# EAGLE schematic switch_driver (EAGLE 7.3.0)
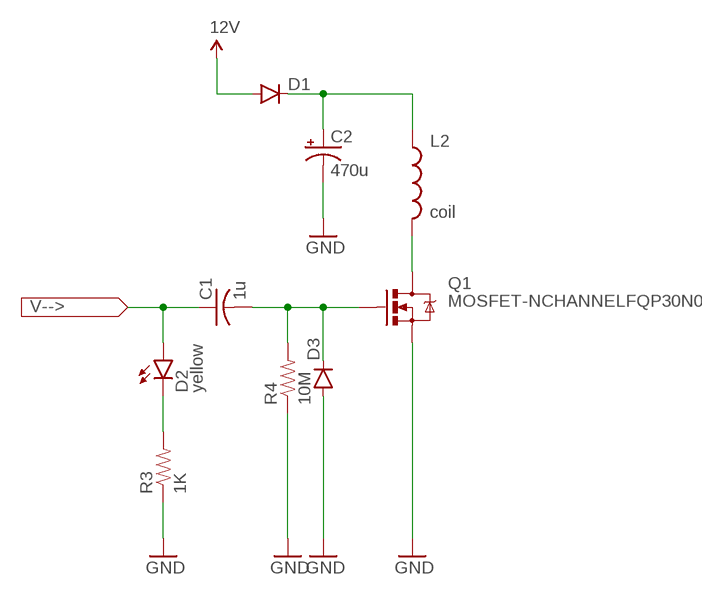
[diagram p0: schematic, sheet 1]

## Parts
C1  1u  C-US025-024X044  [C025-024X044]
C2  470u  CAP_POLPTH1  [CPOL-RADIAL-100UF-25V]
D1  DIODE1N4148  [DIODE-1N4148]
D2  yellow  LED5MM  [LED5MM]
D3  DIODE1N4148  [DIODE-1N4148]
L2  coil  INDUCTOR  [INDUCTOR-SRP4020]
Q1  MOSFET-NCHANNELFQP30N06L  [TO220V]
R3  1K  1KOHM-1/4W-1%(PTH)  [AXIAL-0.3]
R4  10M  RESISTORAXIAL-0.3  [AXIAL-0.3]

## Nets
12V: D1.A
GND: C2.2(-) D3.A R3.P$1 R4.P$1
N$1: C1.1 D2.A
N$2: D2.K(C) R3.P$2
N$3: C1.2 D3.C Q1.1(G) R4.P$2
N$4: L2.P$2 Q1.2(D)
N$5: C2.1(+) D1.C L2.P$1
Unconnected: Q1.3(S)

## Library data of the parts
C1 = resistor:C-US: CAPACITOR, American symbol
C2 = SparkFun-Passives:CAP_POL: Capacitor Polarized These are standard SMD and PTH capacitors. Normally 10uF, 47uF, and 100uF in electrolytic and tantalum varieties. Always verify the external diameter of the through hole cap, it varies with capacity, voltage, and manufacturer. The EIA devices should be standard.
D1 D3 = SparkFun-DiscreteSemi:DIODE: Diode These are standard reverse protection diodes and small signal diodes. SMA package can handle up to about 1A. SOD-323 can handle about 200mA. What the SOD-323 package when ordering, there are some mfgs out there that are 5-pin packages.
D2 = SparkFun-LED:LED: LEDs Standard schematic elements and footprints for 5mm, 3mm, 1206, and 0603 sized LEDs. 5mm - Spark Fun Electronics SKU : COM-00529 (and others)
L2 = SparkFun-Passives:INDUCTOR: Inductors Basic Inductor/Choke - 0603 and 1206. Footprints are not proven and vary greatly between part numbers. INDUCTOR POWER 3.3UH 4.0A SMD 0.197" L x 0.197" W x 0.177" H (5.00mm x 5.00mm x 4.50mm)
Q1 = SparkFun-DiscreteSemi:MOSFET-NCHANNEL: Common NMOSFET Parts MFG P/N Store ID Prod ID FDD8780 TRANS-09984 SI7820DN TRANS-11055 FDS6630A IC-08089 2N7002PW TRANS-11151 FQP30N06L COM-10213 TRANS-10060 BSS123LT1G TRANS-08345 BSS138 TRANS-00830 BS170 2N7000; PROD_ID: TRANS-10060
R3 = SparkFun-Resistors:1KOHM-1/4W-1%(PTH): RES-12182; PROD_ID: RES-12182
R4 = SparkFun-Resistors:RESISTOR: Resistor Basic schematic elements and footprints for 0603, 1206, and PTH resistors.